# Altium project Driver Morpheus PONTE H.PrjPcb
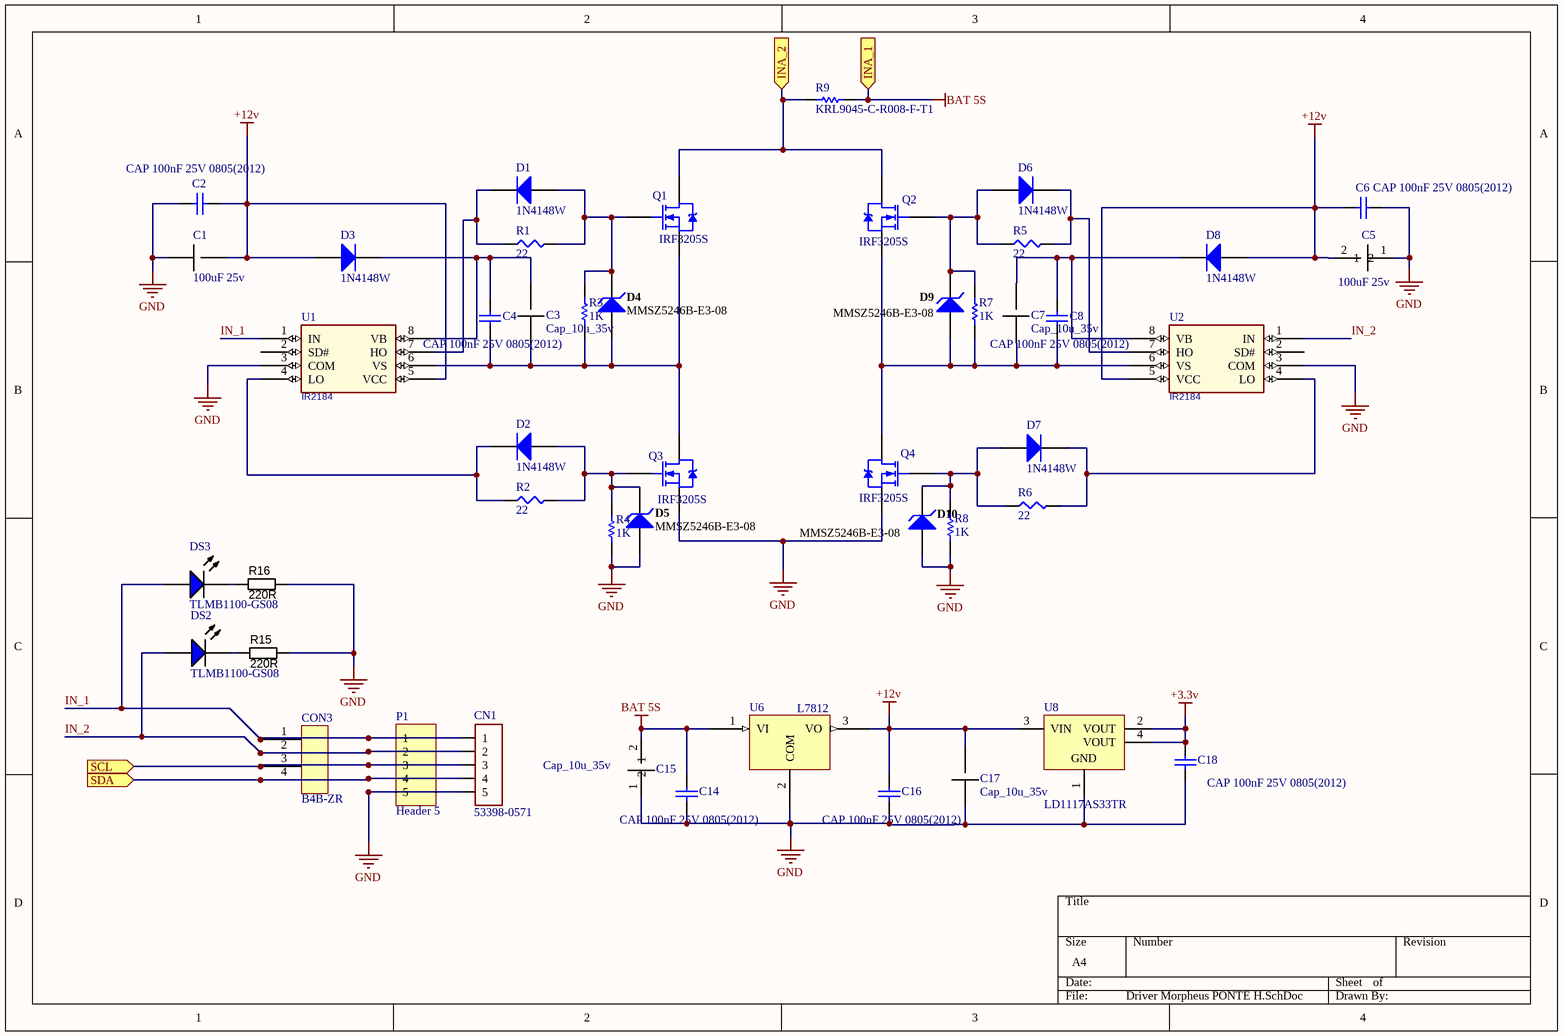
[diagram p0: Driver Morpheus PONTE H.SchDoc]
2 sheets, 58 parts. Net scope: flat (ports and power ports of the same name join across sheets).
Board file: Driver Morpheus PONTE H.PcbDoc
Sheets:
  Driver Morpheus PONTE H.SchDoc
  Driver Morpheus SENSOR CORRENTE.SchDoc

## Sheet Driver Morpheus PONTE H.SchDoc
size A4

### Parts
(Parts that share a designator on the sheet are numbered #1, #2 ... from top to bottom, then left to right.)
C1  100uF 25v  [CAPAE9083X70M]
C2  CAP 100nF 25V 0805(2012)  [CAPC0805(2012)145_M]
C3  Cap_10u_35v  [CAP POL 2917/7343]
C4  CAP 100nF 25V 0805(2012)  [CAPC0805(2012)145_M]
C5  100uF 25v  [CAPAE9083X70M]
C6  CAP 100nF 25V 0805(2012)  [CAPC0805(2012)145_M]
C7  Cap_10u_35v  [CAP POL 2917/7343]
C8  CAP 100nF 25V 0805(2012)  [CAPC0805(2012)145_M]
C14  CAP 100nF 25V 0805(2012)  [CAPC0805(2012)145_M]
C15  Cap_10u_35v  [CAP POL 2917/7343]
C16  CAP 100nF 25V 0805(2012)  [CAPC0805(2012)145_M]
C17  Cap_10u_35v  [CAP POL 2917/7343]
C18  CAP 100nF 25V 0805(2012)  [CAPC0805(2012)145_M]
CN1  53398-0571  [53398-05]
CON3  B4B-ZR  [B4B-ZR]
D1  1N4148W  [JSCJ-SOD-123-2_V]
D2  1N4148W  [JSCJ-SOD-123-2_V]
D3  1N4148W  [JSCJ-SOD-123-2_V]
D4  MMSZ5246B-E3-08  [VISH-SOD-123-2_V]
D5  MMSZ5246B-E3-08  [VISH-SOD-123-2_V]
D6  1N4148W  [JSCJ-SOD-123-2_V]
D7  1N4148W  [JSCJ-SOD-123-2_V]
D8  1N4148W  [JSCJ-SOD-123-2_V]
D9  MMSZ5246B-E3-08  [VISH-SOD-123-2_V]
D10  MMSZ5246B-E3-08  [VISH-SOD-123-2_V]
DS2  TLMB1100-GS08  [VISH-TLMX1100-2_V]
DS3  TLMB1100-GS08  [VISH-TLMX1100-2_V]
P1  Header 5  [HDR1X5]
Q1  IRF3205S  [D2PAK_N]
Q2  IRF3205S  [D2PAK_N]
Q3  IRF3205S  [D2PAK_N]
Q4  IRF3205S  [D2PAK_N]
R1  22  [SMD-0603-RES]
R2  22  [SMD-0603-RES]
R3  value 1K  [RES-0402]  (hidden comment: RC0402JR-071KL)
R4  value 1K  [RES-0402]  (hidden comment: RC0402JR-071KL)
R5  22  [SMD-0603-RES]
R6  22  [SMD-0603-RES]
R7  value 1K  [RES-0402]  (hidden comment: RC0402JR-071KL)
R8  value 1K  [RES-0402]  (hidden comment: RC0402JR-071KL)
R9  KRL9045-C-R008-F-T1  [RESC6332X09M]
R15#1  value 220R  [RESC1608X55N]  (hidden comment: Thick Film)
R16#1  value 220R  [RESC1608X55N]  (hidden comment: Thick Film)
U1  IR2184
U2  IR2184
U6  L7812  [D2PAK-3]
U8  LD1117AS33TR  [SOT-223_M]

### Ports
INA_1 (in), INA_2 (in), SCL (in), SDA (in)

### Nets
+3.3v: C18.2 U8.2(VOUT) U8.4(VOUT)
+12v: C1.2 C2.2 C5.2 C6.2 C16.2 C17.2 D3.1(+) D8.1(+) U1.5(VCC) U2.5(VCC) U6.3(VO) U8.3(VIN)
BAT 5S: C14.2 C15.2 R9.1 U6.1(VI) ; port INA_1
GND: C1.1 C2.1 C5.1 C6.1 C14.1 C15.1 C16.1 C17.1 C18.1 CN1.5 D5.1(A) D10.1(A) P1.5 Q3.3(S) Q4.3(S) R4.1 R8.1 R15#1.2 R16#1.2 U1.3(COM) U2.3(COM) U6.2(COM) U8.1(GND)
IN_1: CN1.1 CON3.1 DS3.1(A) P1.1 U1.1(IN)
IN_2: CN1.2 CON3.2 DS2.1(A) P1.2 U2.1(IN)
NetC3_1: C3.1 C4.1 D4.1(A) Q1.3(S) Q3.2(D) R3.1 U1.6(VS)
NetC3_2: C3.2 C4.2 D3.2(-) U1.8(VB)
NetC7_1: C7.1 C8.1 D9.1(A) Q2.3(S) Q4.2(D) R7.1 U2.6(VS)
NetC7_2: C7.2 C8.2 D8.2(-) U2.8(VB)
NetCN1_3: CN1.3 CON3.3 P1.3 ; port SCL
NetCN1_4: CN1.4 CON3.4 P1.4 ; port SDA
NetD1_1: D1.1(+) D4.2(K) Q1.1(G) R1.2 R3.2
NetD1_2: D1.2(-) R1.1 U1.7(HO)
NetD2_1: D2.1(+) D5.2(K) Q3.1(G) R2.2 R4.2
NetD2_2: D2.2(-) R2.1 U1.4(LO)
NetD6_1: D6.1(+) D9.2(K) Q2.1(G) R5.1 R7.2
NetD6_2: D6.2(-) R5.2 U2.7(HO)
NetD7_1: D7.1(+) D10.2(K) Q4.1(G) R6.1 R8.2
NetD7_2: D7.2(-) R6.2 U2.4(LO)
NetDS2_2: DS2.2(K) R15#1.1
NetDS3_2: DS3.2(K) R16#1.1
NetQ1_2: Q1.2(D) Q2.2(D) R9.2 ; port INA_2

Not connected (* = marked no-connect by the designer): U1 2(SD#); U2 2(SD#)

### Library data of the parts
C1 = Cap_10u_35v
C2 C4 C6 C8 C14 C16 C18 = CMP-1036-04408-1: CAP 100nF 25V ±5% 0805 (2012 Metric) Thickness 1.45mm SMD; Case-Metric: 2012; Case-EIA: 0805; Tolerance: Â±5%; Value: 100nF; Rated Voltage: 25 V; Max Thickness: 1.45 mm; Technology: SMT
C5 = Cap_100u_25v: Cap Tântalo
CN1 = 53398-0571-5: CONN HEADER 5POS 1.25MM VERT SM; Cod EMS: 05.285.005.201; Part No: 53398-0571
D1-D3 D6-D8 = CMP-0914-00001-1: Fast Switching Diode, 75 V, 150 mA, 2-Pin 2.7 x 1.6 x 1.25 mm SMD, Tape and Reel; Manufacturer: Changjiang Electronics; TSTG (degC): -55 to 150; IR (uA): 1; VR (V): 75; VF (V): 1.25; PD (mW): 350; Trr (ns): 4; IO (mA): 150; Packing: Tape and Reel; ComponentLink2URL: http://www.cj-elec.com/txUpfile/20121613352740313.pdf; PackageReference: SOD-123-2; PackageVersion: Rev. A; DatasheetVersion: Rev. A; ComponentLink3Description: Package Specification; ComponentLink3URL: http://www.cj-elec.com/txUpfile/201412112231195145.pdf; ComponentLink1Description: Manufacturer URL; ComponentLink1URL: http://www.cj-elec.com/; PartNumber: 1N4148W; ComponentLink2Description: Datasheet; PackageDescription: 2-Pin SMD, Body 2.7 x 1.6 mm, Height 1.25 mm; Mounting Technology: Surface Mount
D4 D5 D9 D10 = CMP-0931-00032-1: Small Signal Zener Diode, 16 V +/- 5%, -55 to 155 degC, 2-Pin SOD-123, RoHS, Tape and Reel; Manufacturer: Vishay Semiconductor; Test Current (IZT1) (mA): 7.8; Zener Impedance (IZT1) (Max.) (Ohm): 17; Int. Construction: Single; Tolerance: +/- 5%; Power Dissipation (mW): 500; Zener Voltage (NOM.) (V): 16; ComponentLink1URL: http://www.vishay.com/; PackageReference: SOD-123-2; PartNumber: MMSZ5246B-E3-08; ComponentLink2Description: Datasheet; Operating Temperature: -55 to 150 degC; PackageDescription: 2-Pin SMD, Body 2.7 x 1.55 mm, Height 1.35 mm; ComponentLink2URL: http://www.vishay.com/docs/85774/mmsz5225.pdf; DatasheetVersion: Rev. 1.9; RoHS: TRUE; Packing: Tape and Reel; ComponentLink1Description: Manufacturer URL; Mounting Technology: Surface Mount; PackageVersion: Rev. 1.9; ComponentLink3URL: http://www.vishay.com/docs/85774/mmsz5225.pdf; ComponentLink3Description: Package Specification
DS2 DS3 = CMP-1666-00028-1: Blue LED, 10 mA, 3.9 V, -40 to 100 degC, 2-Pin SMD (0603), RoHS, Tape and Reel; Tolerance: 10%; Voltage Rating: 100 V; Capacitance: 10 nF; Type (Capacitors): X7R; Case\Package: Radial; ComponentLink1Description: Manufacturer URL; REACH SVHC: No SVHC; Package Quantity: 500; PackageDescription: 2-Pin Surface Mount Device, Body 1.6 x 0.8 mm; Pins: 2; ComponentLink2URL: http://download.siliconexpert.com/pdfs/2016/8/7/12/43/26/667/vsh_/manual/379263299541529tlmb1100.pdf; RoHSCompliant: true; Lead Pitch: 2.54 mm; Height: 2.54 mm; DatasheetVersion: Rev. 2.7, 03/2016; Length: 5.33 mm; ComponentLink1URL: http://www.vishay.com/; Min Operating Temperature: -55 degC; PackageReference: 0603; Packaging: Bulk; ComponentLink2Description: Datasheet; Max Operating Temperature: 125 degC; Radiation Hardening: No; Width: 3.81 mm; Mount: Through Hole
P1 = Header 5: Header, 5-Pin; LatestRevisionDate: 17-Jul-2002; LatestRevisionNote: Re-released for DXP Platform.; Publisher: Altium Limited
Q1-Q4 = IRF3205S: HEXFET Power MOSFET; Published: 8-Jun-2000; LatestRevisionDate: 20-Nov-2009; LatestRevisionNote: IPC-7351 Footprint Added.; DatasheetVersion: Aug-1997; PackageReference: D2PAK; Publisher: Altium Limited; PackageDescription: 3-Pin Transistor Outline Package 2.54 mm Pitch, 15.1 mm Lead Span; ComponentLink1Description: Manufacturer Link; ComponentLink1URL: http://www.irf.com/; ComponentLink2Description: Datasheet; ComponentLink2URL: http://www.irf.com/product-info/datasheets/data/irf3205s.pdf
R1 R2 R5 R6 = ERJ-3EKF22R0V: RES SMD 22 OHM 1% 1/10W 0603; Manufacturer: Panasonic Electronic Components; Factory Stock: 0; Unit Price (USD): 0.00379; @ qty: 1500; Minimum Quantity: 1; Power (Watts): 0.1W, 1/10W; Temperature Coefficient: ±100ppm/°C; Part Number: ERJ-3EKF22R0V; Datasheets: http://industrial.panasonic.com/www-cgi/jvcr13pz.cgi?E+PZ+3+AOA0002+ERJ3EKF22R0V+7+WW; Image: //media.digikey.com/Photos/Panasonic%20Photos/MFG_ERJ-P6W%20Series.jpg; Digi-Key Part Number: P22.0HCT-ND; Quantity Available: 100321; Packaging: Cut Tape (CT); Series: ERJ; Part Status: Active; Value: 22; Tolerance: ±1%; Composition: Thick Film; Features: Automotive AEC-Q200; Operating Temperature: -55°C ~ 155°C; Package / Case: 0603 (1608 Metric); Supplier Device Package: 0603; Size / Dimension: 0.063" L x 0.031" W (1.60mm x 0.80mm); Height - Seated (Max): 0.022" (0.55mm); Number of Terminations: 2; Failure Rate: -
R3 R4 R7 R8 = RES 1K 0402: RES SMD 1K OHM 5% 1/16W 0402
R9 = CMP-1666-00018-2: Chip Resistor, 0.008 Ohm, +/- 1%, 4 W; PartNumber: WSLP12061L000FEA; Resistance: 0.001 Ohm; RoHSCompliant: True; Mounting Technology: Surface Mount; ComponentLink1URL: http://www.vishay.com/; Min Operating Temperature: -65 degC; Height: 0.635 mm; ComponentLink2URL: http://www.farnell.com/datasheets/2049155.pdf; Length: 3.2 mm; ComponentLink2Description: Datasheet; ComponentLink1Description: Manufacturer URL; DatasheetVersion: 04/2015; Case Code (Imperial): 1206; Max Operating Temperature: 170 degC; Packaging: Tape and Reel; Tolerance: 1%; Case/Package: 1206; Width: 1.6 mm; REACH SVHC: Unknown; PackageDescription: 2-Pin Surface Mount Device, Body 3.2 x 1.6 mm; Case Code (Metric): 3216
R15#1 R16#1 = RES_220R_0603_5%: Resistor SMD chip 220 Ohm 0.1W 5% 0603; Manufacturer 1: Yageo; Manufacturer Part Number 1: RC0603JR-07220RL; Ratings: 1/10 W; SCDType: spec; Manufacturer 5: Royal Ohm; Manufacturer Part Number 5: 0603WAJ0221; Package / Case: 0603 (1608 metric); Tolerance: ±5%; Material: Thick Film; Supplier 1: Digi-Key; Supplier Part Number 1: 311-220GRCT-ND; Supplier 2: Digi-Key; Supplier Part Number 2: P220GCT-ND; Manufacturer 2: Panasonic Electronic Components; Manufacturer Part Number 2: ERJ-3GEYJ221V; RoHS 2: RoHS Compliant; ComponentLink2URL: http://industrial.panasonic.com/www-cgi/jvcr13pz.cgi?E+PZ+3+AOA0001+ERJ3GEYJ221V+7+WW; ComponentLink2Description: http://industrial.panasonic.com/www-cgi/jvcr13pz.cgi?E+PZ+3+AOA0001+ERJ3GEYJ221V+7+WW; ComponentLink1URL: http://www.yageo.com/documents/recent/PYu-RC0603_51_RoHS_L_4.pdf; ComponentLink1Description: http://www.yageo.com/documents/recent/PYu-RC0603_51_RoHS_L_4.pdf; Supplier 3: Digi-Key; Supplier Part Number 3: RMCF0603JT220RCT-ND; Manufacturer 3: Stackpole Electronics Inc; Manufacturer Part Number 3: RMCF0603JT220R; RoHS 3: RoHS Compliant; ComponentLink3URL: http://www.seielect.com/Catalog/SEI-RMCF_RMCP.pdf; ComponentLink3Description: http://www.seielect.com/Catalog/SEI-RMCF_RMCP.pdf; Supplier 4: Digi-Key; Supplier Part Number 4: RHM220CGCT-ND; Manufacturer 4: Rohm Semiconductor; Manufacturer Part Number 4: MCR03ERTJ221; RoHS 4: RoHS Compliant; ComponentLink4URL: http://rohmfs.rohm.com/en/products/databook/datasheet/passive/resistor/chip_resistor/mcr_g.pdf; ComponentLink4Description: http://rohmfs.rohm.com/en/products/databook/datasheet/passive/resistor/chip_resistor/mcr_g.pdf; RoHS 1: RoHS Compliant
U1 U2 = IR2184: PSpiceTemplate: X^@REFDES %VCC %IN %SD %COM %VB %HO %VS %LO @MODEL PARAMS:  ?CDELAY|CDELAY=@CDELAY||CDELAY=50N| ?RDELAY|RDELAY=@RDELAY||RDELAY=50| ?T1|T1=@T1||T1=-40| ?T2|T2=@T2||T2=25| ?T3|T3=@T3||T3=125| ?V1|V1=@V1||V1=10| ?V2|V2=@V2||V2=15| ?V3|V3=@V3||V3=20| ?TOFFT1|TOFFT1=@TOFFT1||TOFFT1=270N| ?TOFFT2|TOFFT2=@TOFFT2||TOFFT2=270N| ?TOFFT3|TOFFT3=@TOFFT3||TOFFT3=270N| ?TOFFV1|TOFFV1=@TOFFV1||TOFFV1=270N| ?TOFFV2|TOFFV2=@TOFFV2||TOFFV2=270N| ?TOFFV3|TOFFV3=@TOFFV3||TOFFV3=270N| ?TONT1|TONT1=@TONT1||TONT1=210N| ?TONT2|TONT2=@TONT2||TONT2=210N| ?TONT3|TONT3=@TONT3||TONT3=210N| ?TONV1|TONV1=@TONV1||TONV1=210N| ?TONV2|TONV2=@TONV2||TONV2=210N| ?TONV3|TONV3=@TONV3||TONV3=210N|; TONV3: 210N; TOFFV3: 270N; V3: 20; V2: 15; V1: 10; T3: 125; T2: 25; T1: -40; RDELAY: 50; CDELAY: 50N; TONV2: 210N; TONV1: 210N; TONT3: 210N; TONT2: 210N; TONT1: 210N; TOFFV2: 270N; TOFFV1: 270N; TOFFT3: 270N; TOFFT2: 270N; TOFFT1: 270N
U6 = LM7812
U8 = CMP-0244-00316-1: 1A, Low Drop Positive Voltage Regulator, 3.3V, 4-Pin SOT-223, Tape and Reel; ComponentLink1Description: Manufacturer URL; DatasheetVersion: 2/12/2011; PackageVersion: 2010; ComponentLink1URL: http://www.st.com; ComponentLink2Description: Datasheet; ComponentLink2URL: http://www.st.com/internet/com/TECHNICAL_RESOURCES/TECHNICAL_LITERATURE/DATASHEET/CD00002116.pdf; PackageDescription: 4-Pin SOT-223 Package, 6.5 x 3.5 mm Body, 2.3 mm Pitch, 7 mm Lead Span; PackageReference: SOT-223

## Sheet Driver Morpheus SENSOR CORRENTE.SchDoc
size A4
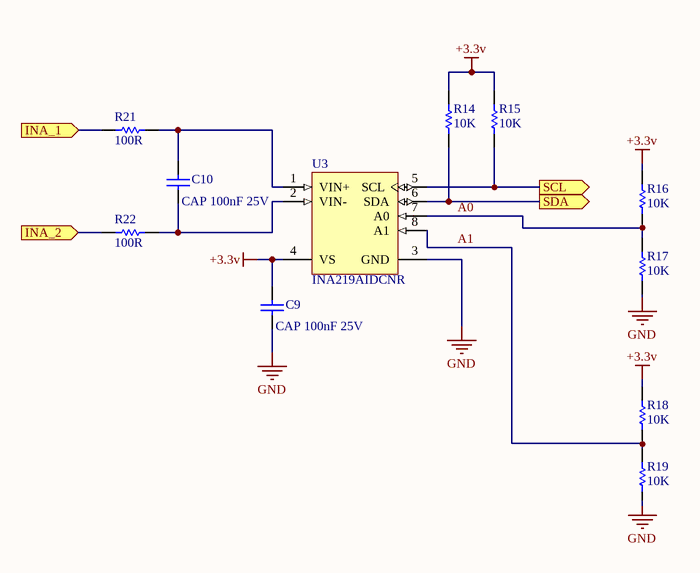
[diagram p1: Driver Morpheus SENSOR CORRENTE.SchDoc]

### Parts
(Parts that share a designator on the sheet are numbered #1, #2 ... from top to bottom, then left to right.)
C9  CAP 100nF 25V  [CAPC0402(1005)60_L]
C10  CAP 100nF 25V  [CAPC0402(1005)60_L]
R14  value 10K  [RES-0402]  (hidden comment: RC0402JR-071KL)
R15#2  value 10K  [RES-0402]  (hidden comment: RC0402JR-071KL)
R16#2  value 10K  [RES-0402]  (hidden comment: RC0402JR-071KL)
R17  value 10K  [RES-0402]  (hidden comment: RC0402JR-071KL)
R18  value 10K  [RES-0402]  (hidden comment: RC0402JR-071KL)
R19  value 10K  [RES-0402]  (hidden comment: RC0402JR-071KL)
R21  value 100R  [RES-0402]  (hidden comment: RC0402JR-071KL)
R22  value 100R  [RES-0402]  (hidden comment: RC0402JR-071KL)
U3  INA219AIDCNR  [DCN0008A_M]

### Ports
INA_1 (in), INA_2 (in), SCL (out), SDA (out)

### Nets
+3.3v: C9.2 R14.2 R15#2.2 R16#2.2 R18.2 U3.4(VS)
BAT 5S: R21.2 ; port INA_1
GND: C9.1 R17.1 R19.1 U3.3(GND)
A0: R16#2.1 R17.2 U3.7(A0)
A1: R18.1 R19.2 U3.8(A1)
NetC10_1: C10.1 R22.1 U3.2(VIN-)
NetC10_2: C10.2 R21.1 U3.1(VIN+)
NetCN1_3: R15#2.1 U3.5(SCL) ; port SCL
NetCN1_4: R14.1 U3.6(SDA) ; port SDA
NetQ1_2: R22.2 ; port INA_2

### Library data of the parts
C9 C10 = CMP-1034-02073-1: CAP 100nF 25V ±20% 0402 (1005 Metric) Thickness 0.6mm SMD; Tolerance: Â±20%; Case-EIA: 0402; Case-Metric: 1005; Rated Voltage: 25 V; Value: 100nF; Max Thickness: 0.6 mm; Technology: SMT
R14 R15#2 R16#2 R17-R19 = RES 1K 0402: RES SMD 10K OHM 5% 1/16W 0402
R21 R22 = RES 1K 0402: RES SMD 100 OHM 5% 1/16W 0402
U3 = CMP-0704-00041-2: Zero-Drift, Bi-directional Current / Power Monitor, 3 to 5.5 V, -40 to 125 degC, 8-pin SOP (DCN8), Green (RoHS & no Sb/Br); Manufacturer: Texas Instruments; Input Offset (+/-)(Max)(uV): 100; Small-Signal Bandwidth(Typ)(MHz): 0.011; SubFamily: Current Shunt Monitor; Rating: Catalog; Quiescent Current (+/-)(Typ)(mA): 0.7; Vs(Max)(V): 5.5; Common Mode Range(Min)(V): 0; Vs(Min)(V): 3; Common Mode Range(Max)(V): 26; Gain(V/V): 1, 0.5, 0.25, 0.125; ComponentLink3URL: http://www.ti.com/lit/ml/mpds099c/mpds099c.pdf; ComponentLink2URL: http://www.ti.com/general/docs/lit/getliterature.tsp?genericPartNumber=INA219&fileType=pdf; PackageReference: DCN0008A; ComponentLink1URL: http://www.ti.com/; ComponentLink1Description: Manufacturer URL; Code_JEDEC: MO-178; CMRR(Min)(dB): 100; DatasheetVersion: SBOS448F; Mounting Technology: Surface Mount; ComponentLink3Description: Package Specification; PartNumber: INA219AIDCNR; PackageVersion: 4202106/D, 11/2009; Eco-Plan: Green (RoHS & no Sb/Br); ComponentLink2Description: Datasheet; PackageDescription: 8-Pin Plastic Small Outline, Body 1.6 x 2.9 mm, Pitch 0.65 mm

## Nets that join several sheets
+3.3v: Driver Morpheus PONTE H (C18.2 U8.2 U8.4), Driver Morpheus SENSOR CORRENTE (6 pins)
BAT 5S: Driver Morpheus PONTE H (C14.2 C15.2 R9.1 U6.1), Driver Morpheus SENSOR CORRENTE (R21.2)
GND: Driver Morpheus PONTE H (23 pins), Driver Morpheus SENSOR CORRENTE (C9.1 R17.1 R19.1 U3.3)
NetCN1_3: Driver Morpheus PONTE H (CN1.3 CON3.3 P1.3), Driver Morpheus SENSOR CORRENTE (R15#2.1 U3.5)
NetCN1_4: Driver Morpheus PONTE H (CN1.4 CON3.4 P1.4), Driver Morpheus SENSOR CORRENTE (R14.1 U3.6)
NetQ1_2: Driver Morpheus PONTE H (Q1.2 Q2.2 R9.2), Driver Morpheus SENSOR CORRENTE (R22.2)